# Altium project Capybara.PrjPcb (part 3 of 3)
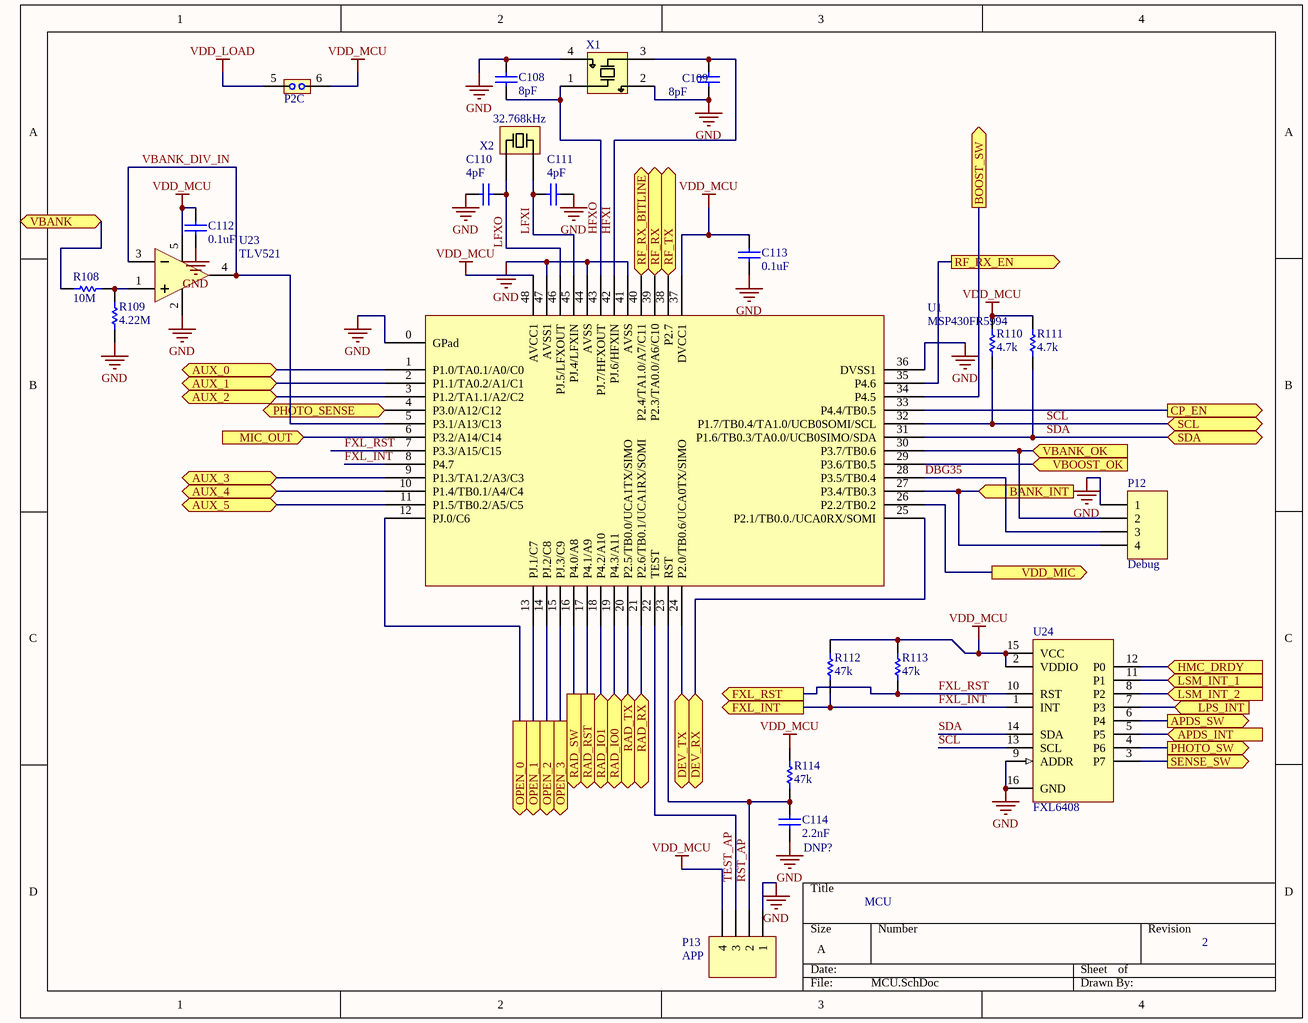
[diagram p12: MCU.SchDoc]

## Nets that join several sheets
GND: Capybara (P9.1 P10.1 P11.1), CapBank (35 pins), CapBank_Introspection (7 pins), CapBank_Supercaps (6 pins), Sensors (38 pins), Sensors_Mic (8 pins), Power (60 pins), Power_VtopControl (12 pins), Radio (36 pins), Harvester_Solar (R46.1 R47.1), Harvester_RF (11 pins), MCU (20 pins)
VCAP: CapBank (C1.1 C2.1 R28.2 R32.2), Power (P2.15)
VDD_LOAD: CapBank (8 pins), Sensors (P2.3), Power (5 pins), Power_VtopControl (R130.1), Radio (P2.7), MCU (P2.5)
VDD_MCU: Capybara (P9.2), CapBank_Introspection (C115.2 R115.2 U25.8), Sensors (C70.2 U17.7), MCU (14 pins)
APDS_INT: Sensors (P6.3 R92.1 U14.2), MCU (U24.5)
APDS_SW: Sensors (R89.2 U13.3), MCU (U24.6)
AUX_0: Capybara (P9.5), MCU (U1.1)
AUX_1: Capybara (P9.4), MCU (U1.2)
AUX_2: Capybara (P9.3), MCU (U1.3)
AUX_3: Capybara (P8.7), MCU (U1.9)
AUX_4: Capybara (P8.2), MCU (U1.10)
AUX_5: Capybara (P8.1), MCU (U1.11)
BANK_1: CapBank (9 pins), CapBank_Introspection (P14.1 R120.2)
BANK_2: CapBank (8 pins), CapBank_Introspection (P14.2 R121.2)
BANK_3: CapBank (9 pins), CapBank_Introspection (P14.3 R122.2)
BANK_4: CapBank (10 pins), CapBank_Introspection (P14.4 R123.2), CapBank_Supercaps (5 pins)
BANK_INT: CapBank_Introspection (R115.1 U25.2), MCU (P12.4 U1.27)
BOOST_SW: Power (C54.2 Q26.1 R86.2), MCU (U1.34)
BQOUT: Capybara (P9.8), Power (C40.2 P1.12 U7.14)
CP_EN: Power_VtopControl (R131.2 U28.3), MCU (U1.33)
DEV_RX: Capybara (P9.7), MCU (U1.25)
DEV_TX: Capybara (P9.6), MCU (U1.24)
FXL_INT: Sensors (P6.8), MCU (R112.1 U1.8 U24.1)
FXL_RST: Sensors (P6.7), MCU (R113.1 U1.7 U24.10)
HMC_DRDY: Sensors (P6.4 U15.15), MCU (U24.12)
LPS_INT: Sensors (P6.2 U16.7), MCU (U24.7)
LSM_INT_1: Sensors (P6.6 U18.4), MCU (U24.11)
LSM_INT_2: Sensors (P6.5 U18.9), MCU (U24.8)
MIC_OUT: Sensors_Mic (C101.2 R103.2 U22.4), MCU (U1.6)
OPEN_0: CapBank (Q12.2), MCU (U1.12)
OPEN_1: CapBank (Q11.2), MCU (U1.13)
OPEN_2: CapBank (Q10.2), MCU (U1.14)
OPEN_3: CapBank (Q9.2), MCU (U1.15)
PHOTO_SENSE: Sensors (Q27.2 R93.2), MCU (U1.4)
PHOTO_SW: Sensors (Q27.1), MCU (U24.4)
RAD_IO0: Radio (U2.23), MCU (U1.19)
RAD_IO1: Radio (U2.24), MCU (U1.18)
RAD_RST: Radio (Q28.1 R98.2), MCU (U1.17)
RAD_RX: Radio (U2.20), MCU (U1.21)
RAD_SW: Radio (R96.2 U19.3), MCU (U1.16)
RAD_TX: Radio (U2.21), MCU (U1.20)
RF_RX: Capybara (P8.5), Harvester_RF (U20.1), MCU (U1.39)
RF_RX_BITLINE: Harvester_RF (C97.2 R100.1 R101.2 U20.3), MCU (U1.40)
RF_RX_EN: Harvester_RF (C96.1 U20.5), MCU (U1.35)
RF_TX: Capybara (P8.6), Harvester_RF (Q29.3 Q29.4), MCU (U1.38)
SCL: Capybara (P10.2), CapBank_Introspection (U25.10), Sensors (U17.6), Power_VtopControl (R128.1), MCU (R110.1 U1.32 U24.13)
SDA: Capybara (P10.3), CapBank_Introspection (U25.9), Sensors (U17.5), Power_VtopControl (R129.1), MCU (R111.1 U1.31 U24.14)
SENSE_SW: Sensors (R90.2 U12.3), MCU (U24.3)
VAR_THR: Power (P3.8), Power_VtopControl (C118.2 U26.6 U27.4)
VAR_THR_EN: Power (R74.2), Power_VtopControl (C117.2 R124.1 U27.1)
VBANK: Capybara (P8.3), Power (12 pins), Power_VtopControl (Q30.2 Q31.3), MCU (R108.1)
VBANK_OK: Power (Q25.2 R65.2), MCU (P12.2 U1.30)
VBOOST_OK: Power (C39.2 P3.3 U8.1), MCU (U1.29)
VDD_MIC: Sensors_Mic (6 pins), MCU (U1.26)
VHarvest: Capybara (P1.2 P1.4 P1.6 P8.4), Power (D28.2 P1.8 R48.1 R49.2)
VHarvest_RF: Capybara (P1.3), Harvester_RF (C93.1 D37.2)
VHarvest_SOL: Capybara (P1.5), Harvester_Solar (R41.2 R42.2)